# Altium schematic sheet connecters.SchDoc
size A4
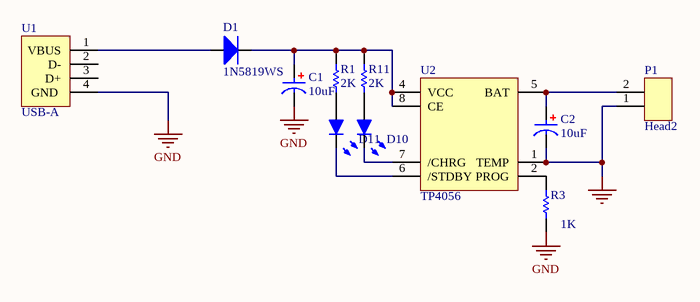
[diagram p0: connecters.SchDoc]

## Parts
C1  C10uF  [0603C]  (value not drawn)
C2  C10uF  [0603C]  (value not drawn)
D1  1N5819WS  [LC-SOD-323F]
D10  LED-B  [LED]  (value not drawn)
D11  LED-R  [LED]  (value not drawn)
P1  Head2  [HEAD2]
R1  R2K  [0603R]  (value not drawn)
R3  1K  [0603R]
R11  R2K  [0603R]  (value not drawn)
U1  USB-A  [USB-A]
U2  TP4056  [SOP-8]

## Nets
GND: C1.2 C2.2 P1.1 R3.1 U1.4(GND) U2.1(TEMP) U2.3(GND)
NetC1_1: C1.1 D1.2(K) R1.2 R11.2 U2.4(VCC) U2.8(CE)
NetC2_1: C2.1 P1.2 U2.5(BAT)
NetD1_1: D1.1(A) U1.1(VBUS)
NetD10_1: D10.1(A) R11.1
NetD10_2: D10.2(K) U2.7(/CHRG)
NetD11_1: D11.1(A) R1.1
NetD11_2: D11.2(K) U2.6(/STDBY)
NetR3_2: R3.2 U2.2(PROG)

Not connected (* = marked no-connect by the designer): U1 2(D-) 3(D+)

## Notes on the sheet
- (in symbol C10uF) 10uF
- (in symbol R1K) 2K

## Library data of the parts
D1 = 1N5822
D10 D11 = LED
R1 R11 = R1K
R3 = R5K